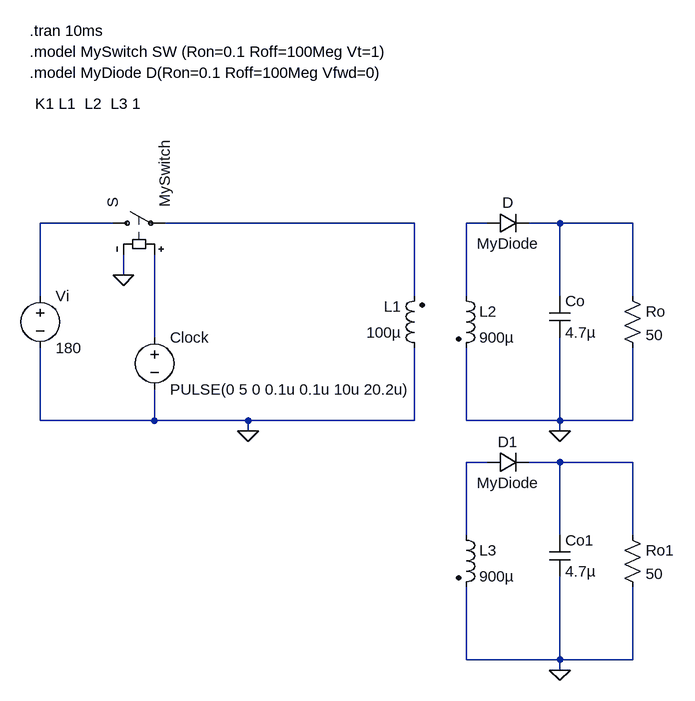
[diagram p0: schematic Flyback Converter Multi Dispense.asc]
Flyback Converter Multi Dispense.asc, the LTspice schematic file:
Version 4
SHEET 1 880 680
WIRE -416 -64 -528 -64
WIRE 48 -64 -336 -64
WIRE 160 -64 128 -64
WIRE 272 -64 224 -64
WIRE 384 -64 272 -64
WIRE -400 16 -400 -16
WIRE -528 48 -528 -64
WIRE 48 48 48 -64
WIRE 128 48 128 -64
WIRE 272 48 272 -64
WIRE 384 48 384 -64
WIRE -352 112 -352 -16
WIRE -528 240 -528 128
WIRE -352 240 -352 192
WIRE -352 240 -528 240
WIRE -208 240 -352 240
WIRE 48 240 48 128
WIRE 48 240 -208 240
WIRE 128 240 128 128
WIRE 272 240 272 112
WIRE 272 240 128 240
WIRE 384 240 384 128
WIRE 384 240 272 240
WIRE -208 256 -208 240
WIRE 272 256 272 240
WIRE 160 304 128 304
WIRE 272 304 224 304
WIRE 384 304 272 304
WIRE 128 416 128 304
WIRE 272 416 272 304
WIRE 384 416 384 304
WIRE 128 608 128 496
WIRE 272 608 272 480
WIRE 272 608 128 608
WIRE 384 608 384 496
WIRE 384 608 272 608
WIRE 272 624 272 608
FLAG -208 256 0
FLAG -400 16 0
FLAG 272 256 0
FLAG 272 624 0
SYMBOL cap 256 48 R0
SYMATTR InstName Co
SYMATTR Value 4.7µ
SYMBOL res 368 32 R0
SYMATTR InstName Ro
SYMATTR Value 50
SYMBOL voltage -352 96 R0
WINDOW 123 0 0 Left 2
WINDOW 39 0 0 Left 2
SYMATTR InstName Clock
SYMATTR Value PULSE(0 5 0 0.1u 0.1u 10u 20.2u)
SYMBOL voltage -528 32 R0
WINDOW 123 0 0 Left 2
WINDOW 39 0 0 Left 2
SYMATTR InstName Vi
SYMATTR Value 180
SYMBOL sw -432 -64 R270
SYMATTR InstName S
SYMATTR Value MySwitch
SYMBOL diode 160 -80 M90
WINDOW 0 0 32 VBottom 2
WINDOW 3 32 32 VTop 2
SYMATTR InstName D
SYMATTR Value MyDiode
SYMBOL ind2 64 144 R180
WINDOW 0 36 80 Left 2
WINDOW 3 36 40 Left 2
SYMATTR InstName L1
SYMATTR Value 100µ
SYMBOL ind2 112 32 R0
SYMATTR InstName L2
SYMATTR Value 900µ
SYMBOL cap 256 416 R0
SYMATTR InstName Co1
SYMATTR Value 4.7µ
SYMBOL res 368 400 R0
SYMATTR InstName Ro1
SYMATTR Value 50
SYMBOL diode 160 288 M90
WINDOW 0 0 32 VBottom 2
WINDOW 3 32 32 VTop 2
SYMATTR InstName D1
SYMATTR Value MyDiode
SYMBOL ind2 112 400 R0
SYMATTR InstName L3
SYMATTR Value 900µ
TEXT -544 -360 Left 2 !.tran 10ms
TEXT -544 -328 Left 2 !.model MySwitch SW (Ron=0.1 Roff=100Meg Vt=1)
TEXT -544 -296 Left 2 !.model MyDiode D(Ron=0.1 Roff=100Meg Vfwd=0)
TEXT -536 -248 Left 2 !K1 L1  L2  L3 1

The netlist it stands for:
* Flyback Converter Multi Dispense.asc
Co N004 0 4.7µ
Ro N004 0 50
V§Clock N005 0 PULSE(0 5 0 0.1u 0.1u 10u 20.2u)
Vi N001 0 180
S N001 N002 N005 0 MySwitch
D N003 N004 MyDiode
L1 0 N002 100µ
L2 N003 0 900µ
Co1 N007 0 4.7µ
Ro1 N007 0 50
D1 N006 N007 MyDiode
L3 N006 0 900µ
.model D D
.lib standard.dio
.tran 10ms
.model MySwitch SW (Ron=0.1 Roff=100Meg Vt=1)
.model MyDiode D(Ron=0.1 Roff=100Meg Vfwd=0)
K1 L1  L2  L3 1
.backanno
.end